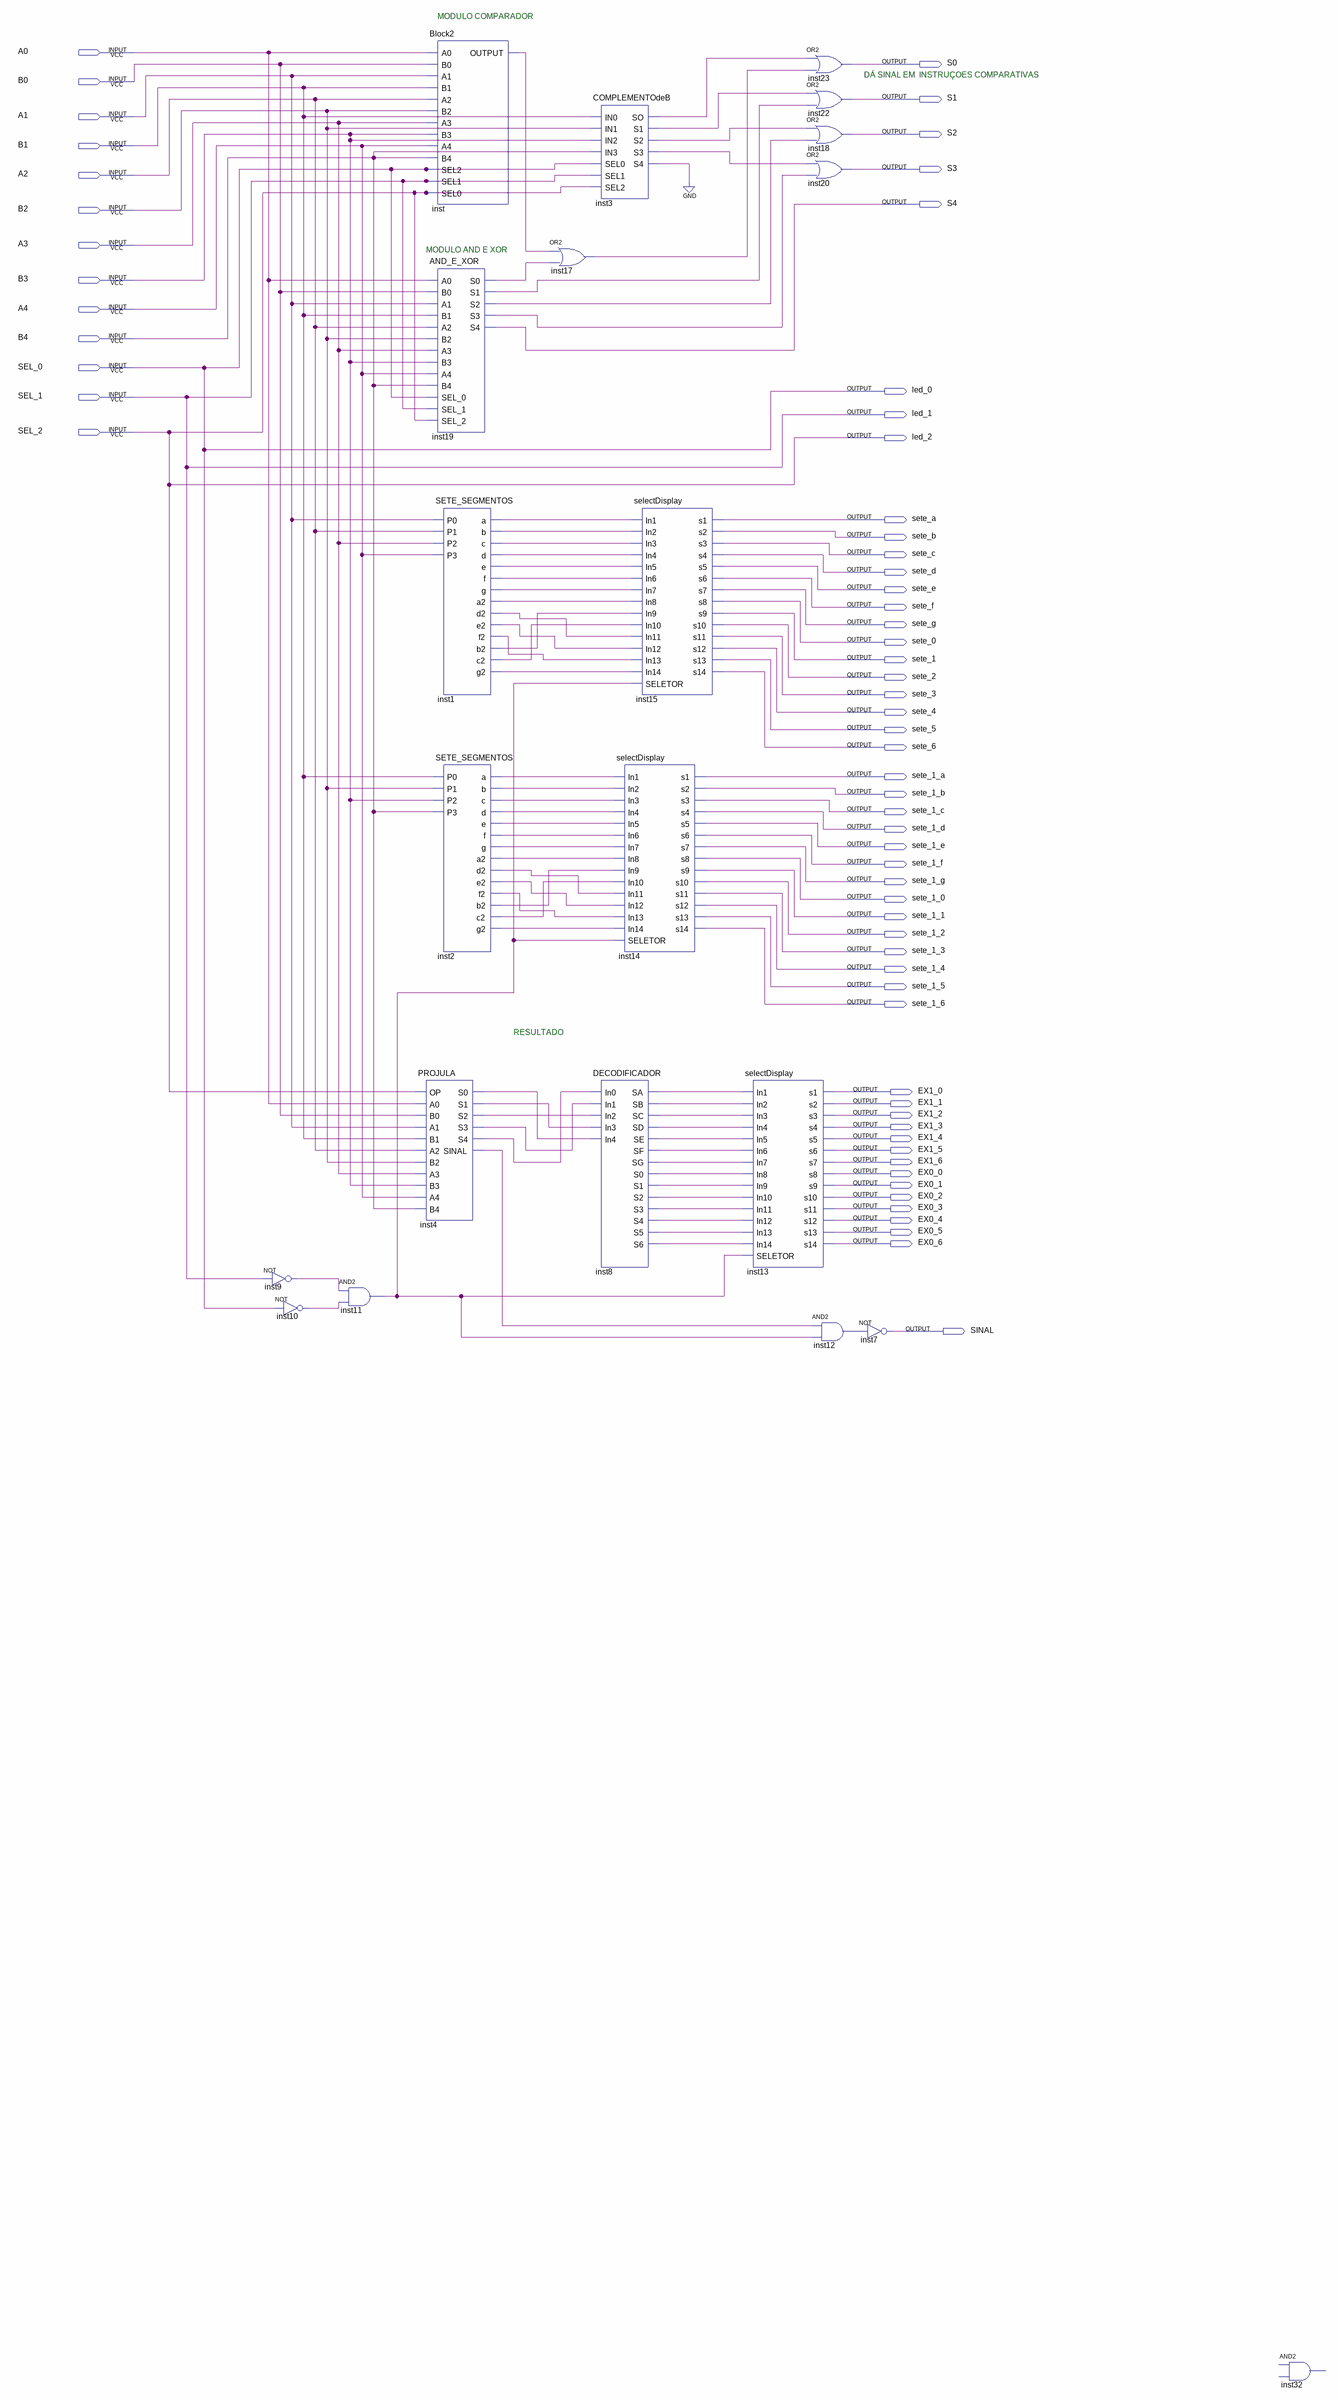
[diagram p0: schematic sheet]
// Quartus schematic MENOR.bdf as structural Verilog: 21 symbols, 64 pins
module MENOR (
  input  A0,
  input  B0,
  input  A1,
  input  B1,
  input  A2,
  input  B2,
  input  A3,
  input  B3,
  input  A4,
  input  B4,
  input  SEL_0,
  input  SEL_1,
  input  SEL_2,
  output S0,
  output S1,
  output S2,
  output S3,
  output S4,
  output led_0,
  output led_1,
  output led_2,
  output sete_a,
  output sete_b,
  output sete_c,
  output sete_d,
  output sete_e,
  output sete_f,
  output sete_g,
  output sete_0,
  output sete_1,
  output sete_2,
  output sete_3,
  output sete_4,
  output sete_5,
  output sete_6,
  output sete_1_a,
  output sete_1_b,
  output sete_1_c,
  output sete_1_d,
  output sete_1_e,
  output sete_1_f,
  output sete_1_g,
  output sete_1_0,
  output sete_1_1,
  output sete_1_2,
  output sete_1_3,
  output sete_1_4,
  output sete_1_5,
  output sete_1_6,
  output EX1_0,
  output EX1_1,
  output EX1_2,
  output EX1_3,
  output EX1_4,
  output EX1_5,
  output EX1_6,
  output EX0_0,
  output EX0_1,
  output EX0_2,
  output EX0_3,
  output EX0_4,
  output EX0_5,
  output EX0_6,
  output SINAL
);

  wire inst1_a, inst1_a2, inst1_b, inst1_b2, inst1_c, inst1_c2, inst1_d, inst1_d2, inst1_e, inst1_e2,
       inst1_f, inst1_f2, inst1_g, inst1_g2, inst2_a, inst2_a2, inst2_b, inst2_b2, inst2_c, inst2_c2,
       inst2_d, inst2_d2, inst2_e, inst2_e2, inst2_f, inst2_f2, inst2_g, inst2_g2, inst3_s1, inst3_s2,
       inst3_s3, inst3_s4, inst3_so, inst4_s0, inst4_s1, inst4_s2, inst4_s3, inst4_s4, inst4_sinal, inst8_s0,
       inst8_s1, inst8_s2, inst8_s3, inst8_s4, inst8_s5, inst8_s6, inst8_sa, inst8_sb, inst8_sc, inst8_sd,
       inst8_se, inst8_sf, inst8_sg, inst9_out, inst10_out, inst11_out, inst12_out, inst17_out, inst19_s0,
       inst19_s1, inst19_s2, inst19_s3, inst_output;

  not inst9 (inst9_out, SEL_1);
  not inst10 (inst10_out, SEL_0);
  and inst11 (inst11_out, inst9_out, inst10_out);
  Block2 inst (
    .A0(A0), .B0(B0), .A1(A1), .B1(B1), .A2(A2), .B2(B2), .A3(A3), .B3(B3), .A4(A4), .B4(B4), .SEL2(SEL_0),
    .SEL1(SEL_1), .SEL0(SEL_2), .OUTPUT(inst_output));
  AND_E_XOR inst19 (
    .A0(A0), .B0(B0), .A1(A1), .B1(B1), .A2(A2), .B2(B2), .A3(A3), .B3(B3), .A4(A4), .B4(B4), .SEL_0(SEL_0),
    .SEL_1(SEL_1), .SEL_2(SEL_2), .S0(inst19_s0), .S1(inst19_s1), .S2(inst19_s2), .S3(inst19_s3), .S4(S4));
  PROJULA inst4 (
    .OP(SEL_2), .A0(A0), .B0(B0), .A1(A1), .B1(B1), .A2(A2), .B2(B2), .A3(A3), .B3(B3), .A4(A4), .B4(B4),
    .S0(inst4_s0), .S1(inst4_s1), .S2(inst4_s2), .S3(inst4_s3), .S4(inst4_s4), .SINAL(inst4_sinal));
  SETE_SEGMENTOS inst1 (
    .P0(A1), .P1(A2), .P2(A3), .P3(A4), .a(inst1_a), .b(inst1_b), .c(inst1_c), .d(inst1_d), .e(inst1_e),
    .f(inst1_f), .g(inst1_g), .a2(inst1_a2), .d2(inst1_d2), .e2(inst1_e2), .f2(inst1_f2), .b2(inst1_b2),
    .c2(inst1_c2), .g2(inst1_g2));
  SETE_SEGMENTOS inst2 (
    .P0(B1), .P1(B2), .P2(B3), .P3(B4), .a(inst2_a), .b(inst2_b), .c(inst2_c), .d(inst2_d), .e(inst2_e),
    .f(inst2_f), .g(inst2_g), .a2(inst2_a2), .d2(inst2_d2), .e2(inst2_e2), .f2(inst2_f2), .b2(inst2_b2),
    .c2(inst2_c2), .g2(inst2_g2));
  or inst17 (inst17_out, inst_output, inst19_s0);
  COMPLEMENTOdeB inst3 (
    .IN0(B1), .IN1(B2), .IN2(B3), .IN3(B4), .SEL0(SEL_0), .SEL1(SEL_1), .SEL2(SEL_2), .SO(inst3_so),
    .S1(inst3_s1), .S2(inst3_s2), .S3(inst3_s3), .S4(inst3_s4));
  selectDisplay inst14 (
    .In1(inst2_a), .In2(inst2_b), .In3(inst2_c), .In4(inst2_d), .In5(inst2_e), .In6(inst2_f), .In7(inst2_g),
    .In8(inst2_a2), .In9(inst2_b2), .In10(inst2_c2), .In11(inst2_d2), .In12(inst2_e2), .In13(inst2_f2),
    .In14(inst2_g2), .SELETOR(inst11_out), .s1(sete_1_a), .s2(sete_1_b), .s3(sete_1_c), .s4(sete_1_d),
    .s5(sete_1_e), .s6(sete_1_f), .s7(sete_1_g), .s8(sete_1_0), .s9(sete_1_1), .s10(sete_1_2),
    .s11(sete_1_3), .s12(sete_1_4), .s13(sete_1_5), .s14(sete_1_6));
  DECODIFICADOR inst8 (
    .In0(inst4_s4), .In1(inst4_s3), .In2(inst4_s2), .In3(inst4_s1), .In4(inst4_s0), .SA(inst8_sa),
    .SB(inst8_sb), .SC(inst8_sc), .SD(inst8_sd), .SE(inst8_se), .SF(inst8_sf), .SG(inst8_sg), .S0(inst8_s0),
    .S1(inst8_s1), .S2(inst8_s2), .S3(inst8_s3), .S4(inst8_s4), .S5(inst8_s5), .S6(inst8_s6));
  selectDisplay inst15 (
    .In1(inst1_a), .In2(inst1_b), .In3(inst1_c), .In4(inst1_d), .In5(inst1_e), .In6(inst1_f), .In7(inst1_g),
    .In8(inst1_a2), .In9(inst1_b2), .In10(inst1_c2), .In11(inst1_d2), .In12(inst1_e2), .In13(inst1_f2),
    .In14(inst1_g2), .SELETOR(inst11_out), .s1(sete_a), .s2(sete_b), .s3(sete_c), .s4(sete_d), .s5(sete_e),
    .s6(sete_f), .s7(sete_g), .s8(sete_0), .s9(sete_1), .s10(sete_2), .s11(sete_3), .s12(sete_4),
    .s13(sete_5), .s14(sete_6));
  selectDisplay inst13 (
    .In1(inst8_sa), .In2(inst8_sb), .In3(inst8_sc), .In4(inst8_sd), .In5(inst8_se), .In6(inst8_sf),
    .In7(inst8_sg), .In8(inst8_s0), .In9(inst8_s1), .In10(inst8_s2), .In11(inst8_s3), .In12(inst8_s4),
    .In13(inst8_s5), .In14(inst8_s6), .SELETOR(inst11_out), .s1(EX1_0), .s2(EX1_1), .s3(EX1_2), .s4(EX1_3),
    .s5(EX1_4), .s6(EX1_5), .s7(EX1_6), .s8(EX0_0), .s9(EX0_1), .s10(EX0_2), .s11(EX0_3), .s12(EX0_4),
    .s13(EX0_5), .s14(EX0_6));
  or inst23 (S0, inst3_so, inst17_out);
  or inst22 (S1, inst3_s1, inst19_s1);
  or inst18 (S2, inst3_s2, inst19_s2);
  or inst20 (S3, inst3_s3, inst19_s3);
  and inst12 (inst12_out, inst4_sinal, inst11_out);
  not inst7 (SINAL, inst12_out);
  // AND2 inst32 is placed but not wired

  assign led_0 = SEL_0;
  assign led_1 = SEL_1;
  assign led_2 = SEL_2;
  // also tied to GND on the sheet: inst3_s4

  // Notes on the sheet:
  //   MODULO COMPARADOR
  //   DÁ SINAL EM  INSTRUÇOES COMPARATIVAS
  //   MODULO AND E XOR
  //   RESULTADO
endmodule
